# Altium project safety2020.PrjPCB
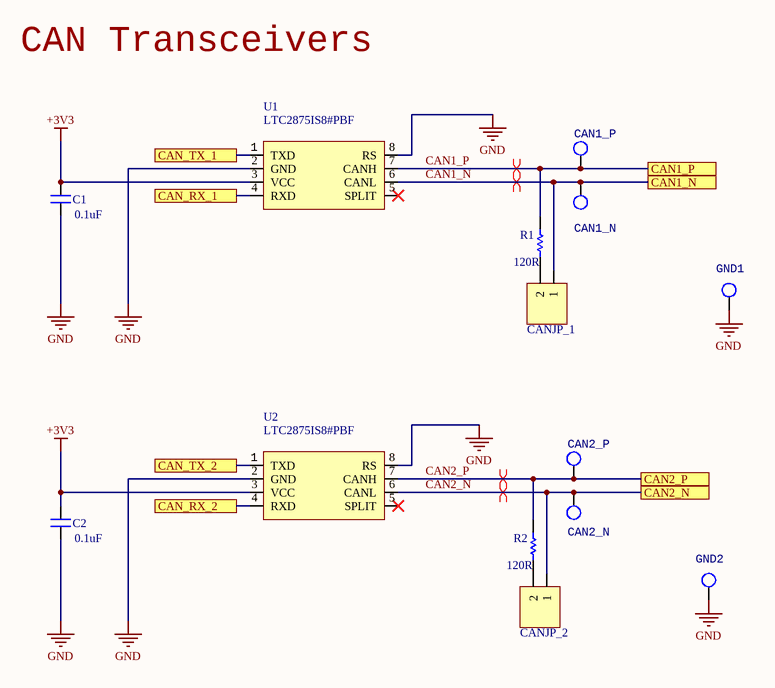
[diagram p0: CAN.SchDoc]
Address1: 200 University Avenue; Address2: Waterloo; Address3: Ontario; Address4: Canada N2L 3G6; BoardName: Your Board Name; DrawnBy: Your Name
2 sheets, 22 parts. Net scope: flat (ports and power ports of the same name join across sheets).
Board file: Safety-Rev1.PcbDoc
Sheets:
  CAN.SchDoc
  POWER.SchDoc

## Sheet CAN.SchDoc: CAN
size Letter; DrawnBy: Qinyang Bao, Nicole Rosario; Organization: UW Robotics; Address1: 200 University Avenue; Address2: Waterloo; Address3: Ontario; Address4: Canada N2L 3G6

### Parts
C1  value 0.1uF  [CAPC0603(1608)55_N]  (hidden comment: CAP_0.1uF_16V_0603)
C2  value 0.1uF  [CAPC0603(1608)55_N]  (hidden comment: CAP_0.1uF_16V_0603)
CAN1_N  TESTPOINT_LOOP  [TESTPOINT_LOOP]  (value not drawn)
CAN1_P  TESTPOINT_LOOP  [TESTPOINT_LOOP]  (value not drawn)
CAN2_N  TESTPOINT_LOOP  [TESTPOINT_LOOP]  (value not drawn)
CAN2_P  TESTPOINT_LOOP  [TESTPOINT_LOOP]  (value not drawn)
CANJP_1  JUMPER_2  [HDR1X2]  (value not drawn)
CANJP_2  JUMPER_2  [HDR1X2]  (value not drawn)
GND1  TESTPOINT_LOOP  [TESTPOINT_LOOP]  (value not drawn)
GND2  TESTPOINT_LOOP  [TESTPOINT_LOOP]  (value not drawn)
R1  value 120R  [RESC0603(1608)_N]  (hidden comment: RES_120R_0603)
R2  value 120R  [RESC0603(1608)_N]  (hidden comment: RES_120R_0603)
U1  MPN: LTC2875IS8#PBF  [LT-S8_N]  (hidden comment: IC TXRX CAN)
U2  MPN: LTC2875IS8#PBF  [LT-S8_N]  (hidden comment: IC TXRX CAN)

### Ports
CAN1_N, CAN1_P, CAN2_N, CAN2_P, CAN_RX_1, CAN_RX_2, CAN_TX_1, CAN_TX_2

### Nets
+3V3: C1.2 C2.2 U1.3(VCC) U2.3(VCC)
GND: C1.1 C2.1 GND1.1 GND2.1 U1.2(GND) U1.8(RS) U2.2(GND) U2.8(RS)
CAN1_N: CAN1_N.1 CANJP_1.1 U1.6(CANL) ; port CAN1_N
CAN1_P: CAN1_P.1 R1.1 U1.7(CANH) ; port CAN1_P
CAN2_N: CAN2_N.1 CANJP_2.1 U2.6(CANL) ; port CAN2_N
CAN2_P: CAN2_P.1 R2.1 U2.7(CANH) ; port CAN2_P
NetCANJP_1_2: CANJP_1.2 R1.2
NetCANJP_2_2: CANJP_2.2 R2.2
NetU1_1: U1.1(TXD) ; port CAN_TX_1
NetU1_4: U1.4(RXD) ; port CAN_RX_1
NetU2_1: U2.1(TXD) ; port CAN_TX_2
NetU2_4: U2.4(RXD) ; port CAN_RX_2

Not connected (* = marked no-connect by the designer): U1 5(SPLIT)*; U2 5(SPLIT)*

### Layout directives
differential pair: CAN1_N, CAN1_P, CAN2_N, CAN2_P

### Notes on the sheet
- CAN Transceivers
- Title
- Size:
- Date:
- Letter
- Drawn By:
- Sheet
- of
- File:

### Library data of the parts
C1 C2 = CAP_0.1uF_16V_0603: CAP CER 0.1UF 16V X7R 0603; MPN: CC0603KRX7R7BB104; Manufacturer: Yageo; Dimensions: 0.063" L x 0.031" W (1.60mm x 0.80mm); Package: 0603 (1608 Metric); Temperature Coefficient: X7R; Voltage Rating: 16V; Supplier Part Number 1: 311-1088-1-ND; Supplier 1: Digi-Key
CAN1_N CAN1_P CAN2_N CAN2_P GND1 GND2 = TESTPOINT_LOOP: Loop testpoint through-hole pad; Manufacturer: Keystone Electronics; Manufacturer Part Number 1: 5002; Supplier Part Number 1: 36-5002-ND; Supplier 1: Digi-Key
CANJP_1 CANJP_2 = JUMPER_2: HEADER 2X1; Supplier 1: Digi-Key; Supplier Part Number 1: A26542-ND
R1 R2 = RES_120R_0603: RES SMD 120 OHM 5% 1/10W 0603; Manufacturer: Yageo; MPN: RC0603JR-07120RL; Package: 0603 (1608 Metric); Dimensions: 0.063" L x 0.031" W (1.60mm x 0.80mm); Tolerance: 5%; Supplier Part Number 1: 311-120GRCT-ND; Supplier 1: Digi-Key
U1 U2 = LTC2875: IC TXRX CAN 4MBPS 8SO; Manufacturer: Linear Technologies; Package: 8-SOIC (0.154", 3.90mm Width); ComponentLink1Description: Datasheet; ComponentLink1URL: https://www.analog.com/media/en/technical-documentation/data-sheets/2875f.pdf; Supplier Part Number 1: LTC2875IS8#PBF-ND; Supplier 1: Digi-Key

## Sheet POWER.SchDoc: Power
size Letter; DrawnBy: Qinyang Bao, Nicole Rosario; Organization: UW Robotics; Address1: 200 University Avenue; Address2: Waterloo; Address3: Ontario; Address4: Canada N2L 3G6
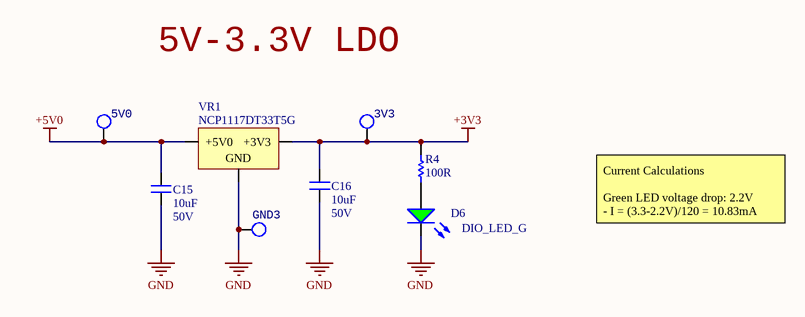
[diagram p1: POWER.SchDoc]

### Parts
3V3  TESTPOINT_LOOP  [TESTPOINT_LOOP]  (value not drawn)
5V0  TESTPOINT_LOOP  [TESTPOINT_LOOP]  (value not drawn)
C15  Voltage Rating: 50V  [CAPC1206(3216)]  (hidden comment: 10uF)
C16  Voltage Rating: 50V  [CAPC1206(3216)]  (hidden comment: 10uF)
D6  DIO_LED_G  [LED_0805_LINE]
GND3  TESTPOINT_LOOP  [TESTPOINT_LOOP]  (value not drawn)
R4  value 100R  [RESC0603(1608)_N]  (hidden comment: RES_100R_0603)
VR1  MPN: NCP1117DT33T5G  [VOLTAGE_REGULATOR]  (hidden comment: 5V0_3V3_LDO)

### Nets
+3V3: 3V3.1 C16.1 R4.2 VR1.2(+3V3)
+5V0: 5V0.1 C15.1 VR1.3(+5V0)
GND: C15.2 C16.2 D6.2(K) GND3.1 VR1.1(GND)
NetD6_1: D6.1(A) R4.1

### Notes on the sheet
- 5V-3.3V LDO
- Current Calculations
  Green LED voltage drop: 2.2V
  - I = (3.3-2.2V)/120 = 10.83mA
- Title
- Size:
- Date:
- Letter
- Drawn By:
- Sheet
- of
- File:

### Library data of the parts
3V3 5V0 GND3 = TESTPOINT_LOOP: as CAN1_N on sheet CAN; Supplier Part Number 1: 36-5002-ND; Supplier 1: Digi-Key
C15 C16 = CAP_10uF_50V_1206: CAP CER 10UF 50V X5R 1206; MPN: GRT31CR61H106KE01L; Manufacturer: Murata; Dimensions: 0.126" L x 0.063" W (3.20mm x 1.6mm); Package: 1206 (3216 Metric); Supplier Part Number 1: 490-12456-1-ND; Supplier 1: Digi-Key; Value: 10uF
D6 = DIO_LED_G: LED GREEN DIFFUSED 0805 SMD; MPN: LG R971-KN-1; Manufacturer: OSRAM; Forward Voltage Drop: 2.2V; Package: 0805 (2012 Metric); Supplier Part Number 1: 475-1410-1-ND; Supplier 1: Digi-Key
R4 = RES_100R_0603: RES SMD 100 OHM 1% 1/10W 0603; Manufacturer: Yageo; MPN: RC0603FR-07100RL; Package: 0603 (1608 Metric); Dimensions: 0.063" L x 0.031" W (1.60mm x 0.80mm); Tolerance: 1%; Supplier Part Number 1: 311-100HRCT-ND; Supplier 1: Digi-Key
VR1 = 5V0_3V3_LDO: IC REG LINEAR 3.3V 1A DPAK; Manufacturer: ON Semiconductor; Current Output: 1A; Supplier Part Number 1: NCP1117DT33T5GOSCT-ND; Supplier 1: Digi-Key

## Nets that join several sheets
+3V3: CAN (C1.2 C2.2 U1.3 U2.3), POWER (3V3.1 C16.1 R4.2 VR1.2)
GND: CAN (8 pins), POWER (5 pins)